# EAGLE design USB_Dongle_Parem (EAGLE 6.5.0)
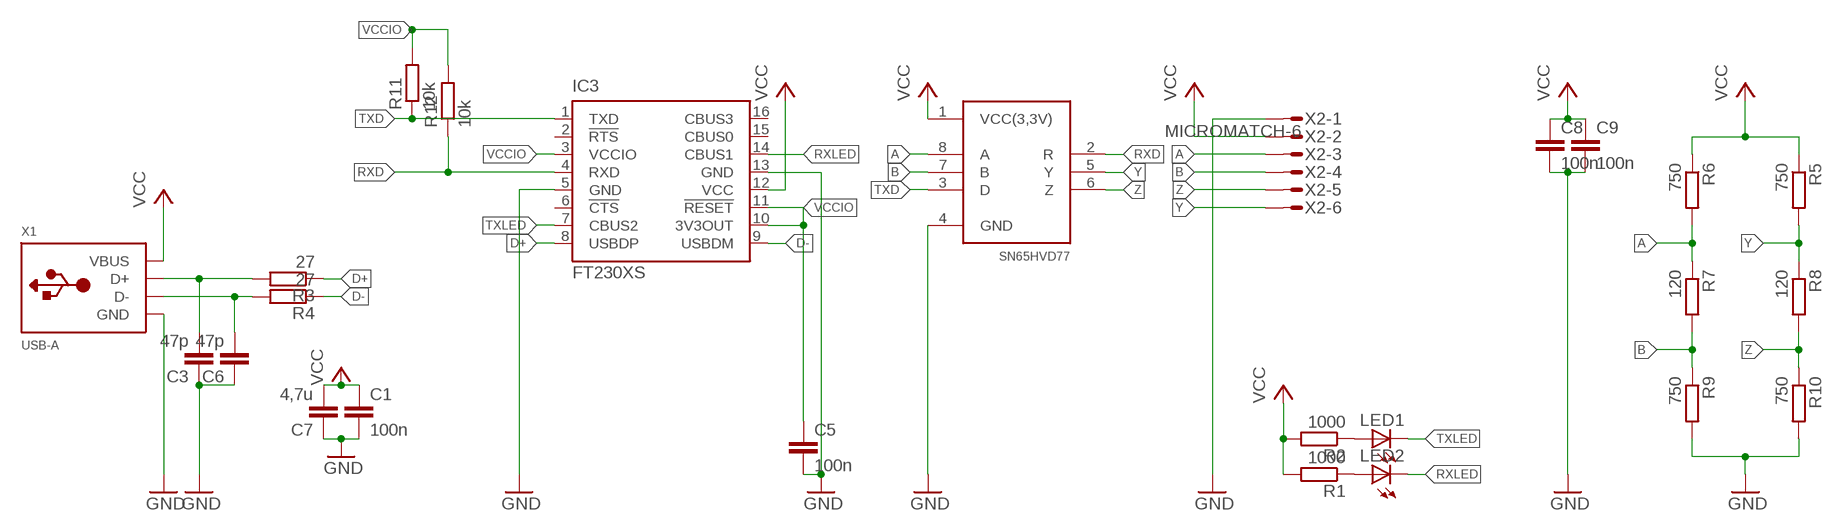
[diagram p0: schematic, sheet 1]

## Parts
C1  100n  CC0603  [C0603]
C3  47p  CC0603  [C0603]
C5  100n  CC0603  [C0603]
C6  47p  CC0603  [C0603]
C7  4,7u  CC1206  [C1206]
C8  100n  CC0603  [C0603]
C9  100n  CC0603  [C0603]
IC3  FT230XS  [SSOP16]
LED1  LED_ESML0603  [LED_SML0603]
LED2  LED_ESML0603  [LED_SML0603]
R1  1000  R-EU_R0603  [R0603]
R2  1000  R-EU_R0603  [R0603]
R3  27  R-EU_R0603  [R0603]
R4  27  R-EU_R0603  [R0603]
R5  750  R-EU_R0603  [R0603]
R6  750  R-EU_R0603  [R0603]
R7  120  R-EU_R0603  [R0603]
R8  120  R-EU_R0603  [R0603]
R9  750  R-EU_R0603  [R0603]
R10  750  R-EU_R0603  [R0603]
R11  10k  R-EU_R0603  [R0603]
R12  10k  R-EU_R0603  [R0603]
U$2  SN65HVD77D  [SOIC-8]
X1  USB-A  [MOLEX_480371000]
X2  MICROMATCH-6  [MICROMATCH-6]

## Nets
A: R6.2 R7.1 U$2.8(A) X2.3
B: R7.2 R9.1 U$2.7(B) X2.4
D+: IC3.8(USBDP) R3.1
D-: IC3.9(USBDM) R4.1
GND: C1.2 C3.1 C5.2 C6.1 C7.1 C8.2 C9.2 IC3.5(GND) IC3.13(GND) R9.2 R10.2 U$2.4(GND) X1.4(GND) X2.1
N$7: LED2.A R1.1
N$8: LED1.A R2.1
RXD: IC3.4(RXD) R12.1 U$2.2(R)
RXLED: IC3.14(CBUS1) LED2.C
SA: C3.2 R3.2 X1.3(D+)
SAD: C6.2 R4.2 X1.2(D-)
TXD: IC3.1(TXD) R11.1 U$2.3(D)
TXLED: IC3.7(CBUS2) LED1.C
VCC: C1.1 C7.2 C8.1 C9.1 IC3.12(VCC) R1.2 R2.2 R5.1 R6.1 U$2.1(VCC(3,3V)) X1.1(VBUS) X2.2
VCCIO: C5.1 IC3.3(VCCIO) IC3.10(3V3OUT) IC3.11(!RESET) R11.2 R12.2
Y: R5.2 R8.1 U$2.5(Y) X2.6
Z: R8.2 R10.1 U$2.6(Z) X2.5
Unconnected: IC3.2(!RTS) IC3.6(!CTS) IC3.15(CBUS0) IC3.16(CBUS3)

## Library data of the parts
C1 C3 C5-C9 = eagle-ltspice:C: CAPACITOR, European symbol; SPICEMODEL: NONE; SPICEPREFIX: C
IC3 = ftdichip:FT230X: USB to BASIC UART IC Auto generated by make-symbol-device-package-bsdl.ulp Rev. 43 Source: Data sheet <http://www.ftdichip.com/Support/Documents/DataSheets/ICs/DS_FT230X.pdf>
LED1 LED2 = eagle-ltspice:LED_E: LED Source: http://www.osram.convergy.de Source: www.luxeon.com Source: www.kingbright.com; SPICEMODEL: NONE; SPICEPREFIX: D; SPICETYPE: diode
R1-R12 = resistor:R-EU_: RESISTOR, European symbol
U$2 = Kommunikatsioon:SN65HVD77D
X1 = adafruit:USB-A: USB type A 'plug' Used for things that can directly connect to a USB port, say USB key
X2 = con-amp-micromatch:MICROMATCH-6: MicroMaTch 6 7-215464-6 / 0-215464-6 Drawing Number C-215464 DDEController.pdf; MPN: 7-215464-6; OC_FARNELL: 3784630; OC_NEWARK: 19R8125

## Board
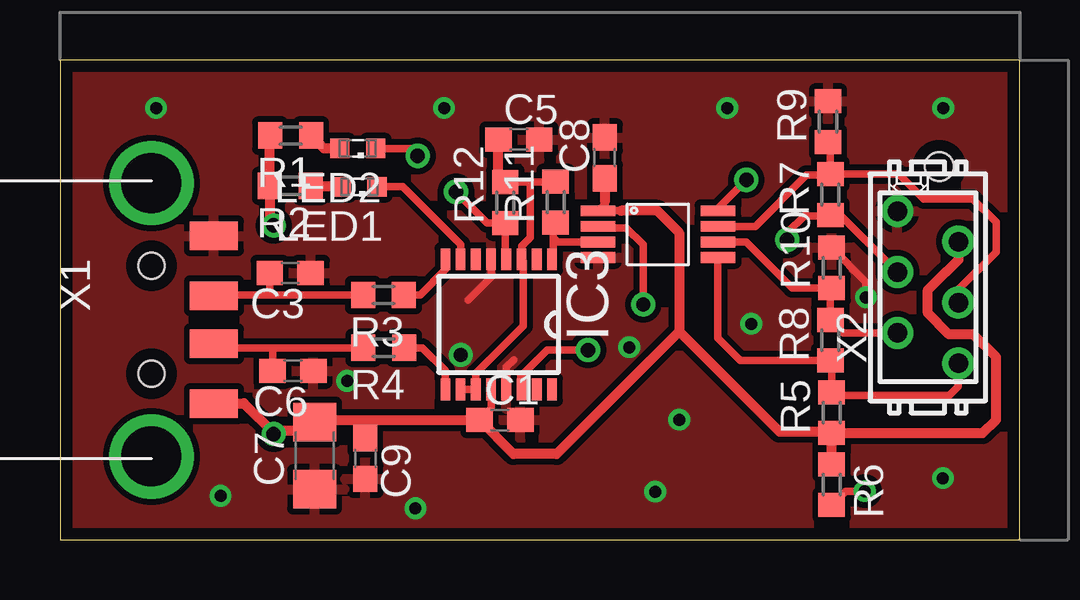
[diagram p1: board, top side]
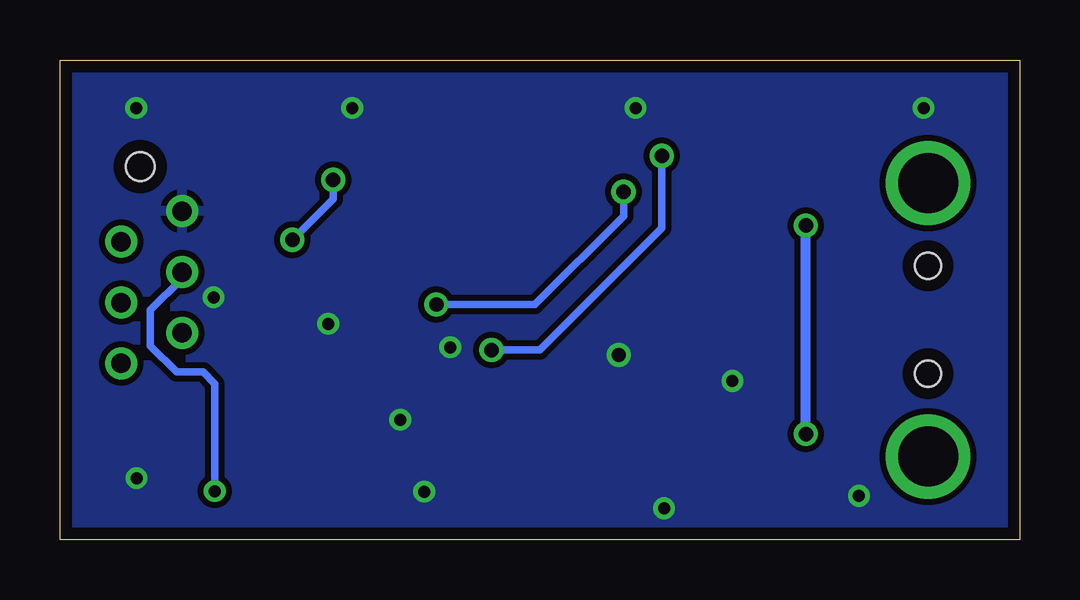
[diagram p2: board, bottom side, seen from below]

Size 39.98 x 20.01 mm. Coordinates in mm from the lower left corner, seen from the top.
Outline: 0,0.01 39.98,0 39.98,20 0,20.01 0,0.01
Copper layers (1*16): Top 0.035mm / dielectric 1.5mm / Bottom 0.035mm
Design rules "EDT_DRC": minimum track width 0.3mm, minimum drill 0.5mm, track to track 0.25mm, track to pad 0.25mm, pad to pad 0.25mm, via to via 0.25mm, smd to smd 0mil, copper to edge 0.5mm, drill to drill 8mil, minimum pad ring 10mil, minimum via ring 8mil, stop-mask expansion 4mil, vias tented up to drill 0mil, thermal gap 10mil
Holes 1.2 mm at 36.64,15.56

### Footprints (pad centres in the part's own frame; a part is rotated, then mirrored left to right if it is on the bottom)
C0603 = smd 1.1 x 1: 1 -0.85,0; 2 0.85,0
C1206 = smd 1.6 x 1.8: 1 -1.4,0; 2 1.4,0
SSOP16 = smd 0.914 x 0.406: 1 -2.718,2.223; 2 -2.718,1.587; 3 -2.718,0.953; 4 -2.718,0.318; 5 -2.718,-0.318; 6 -2.718,-0.953; 7 -2.718,-1.587; 8 -2.718,-2.223; 9 2.718,-2.223; 10 2.718,-1.587; 11 2.718,-0.953; 12 2.718,-0.318; 13 2.718,0.318; 14 2.718,0.953; 15 2.718,1.587; 16 2.718,2.223
LED_SML0603 = smd 0.8 x 0.8: A 0.75,0; C -0.75,0
R0603 = smd 1 x 1.1: 1 -0.85,0; 2 0.85,0
SOIC-8 = smd 0.45 x 1.45: 1 -0.99,-2.49; 2 -0.34,-2.49; 3 0.31,-2.49; 4 0.96,-2.49; 5 0.96,2.51; 6 0.31,2.51; 7 -0.34,2.51; 8 -0.99,2.51
MOLEX_480371000 = smd 1.2 x 2: 1 3.5,2.6; 2 1,2.6; 3 -1,2.6; 4 -3.5,2.6 | drill 2.5: M1 -5.7,0; M2 5.7,0 | hole 1.1: -2.25,0; 2.25,0
MICROMATCH-6 = drill 0.813: 1 3.175,1.27; 2 1.905,-1.27; 3 0.635,1.27; 4 -0.635,-1.27; 5 -1.905,1.27; 6 -3.175,-1.27

### Placement (x,y rotation side)
C1  18.33,4.99 0 top
C3  9.59,11.13 180 top
C5  19.12,16.69 0 top
C6  9.71,7.05 180 top
C7  10.61,3.51 90 top
C8  22.7,15.93 90 top
C9  12.72,3.39 270 top
IC3  18.28,8.98 270 top
LED1  12.46,14.72 180 top
LED2  12.41,16.32 180 top
R1  9.61,16.86 180 top
R2  9.59,14.76 180 top
R3  13.48,10.21 180 top
R4  13.49,8.01 180 top
R5  32.15,5.3 90 top
R6  32.15,2.3 270 top
R7  32.1,14.4 90 top
R8  32.1,8.32 90 top
R9  32,17.44 90 top
R10  32.15,11.34 90 top
R11  20.65,14.08 90 top
R12  18.55,14.06 90 top
U$2  24.91,12.73 270 top
X1  3.81,9.17 270 top
X2  36.16,10.53 90 top

### Tracks (layer width: path | path; a pad name or v marks a point on that pad's centre or on a via)
A  (via drill 0.5, 0.6)
  Top 0.305: U$2.8 27.42,13.83 v28.6,15.01 | v30.3,12.51 30.3,12.81 31,13.51 32.06,13.51 R7.1 32.26,13.71 32.34,13.71 X2.3 | v33.53,2.03 32.73,2.03 R6.2
  Bottom 0.305: v28.6,15.01 28.6,14.21 v30.3,12.51 | X2.3 34.89,10.9 36.21,9.58 36.21,8.08 35.12,6.99 34.02,6.99 33.53,6.5 v33.53,2.03
B
  Top 0.305: U$2.7 28.96,13.07 31.1,15.21 31.59,15.21 | 31.59,15.21 32.06,15.21 R7.2 | R7.2 32.1,16.49 R9.1 | 32.26,15.41 R7.2 | X2.4 37.43,10.43 39,12 39,13.24 38.03,14.21 35.99,14.21 34.95,15.25 R7.2 | 31.61,15.23 31.59,15.21 | 32.13,15.22 R7.2
D+
  Top 0.305: IC3.8 16.06,11.27 15,10.21 R3.1
D-
  Top 0.305: IC3.9 16.06,7.05 15.1,8.01 R4.1
GND  (via drill 0.5, 0.6)
  Top 0.305: IC3.5 17.96,11.05 18,11.01 17,10.01 | IC3.13 18.6,7.01 | 18.6,7.01 | 18.6,7.01 18.6,7.21 18.9,7.51 | v33.58,10.11 33.58,10.76 R10.2
  other vias: 16.7,7.71 11.96,6.62 23.72,8.03 14.81,1.31 16,18.01 4,18.01 24.8,2.01 27.8,18.01 28.8,9.01 36.79,2.57 6.69,1.83 25.8,5.01 36.8,18.01
  pour Top: 0,24.14 49.53,24.14 49.53,0.01 0,0.01
  pour Bottom: 0,24.14 49.53,24.14 49.53,0.01 0,0.01
N$7
  Top 0.406: LED2.A 11,16.32 R1.1
N$8
  Top 0.305: 10.48,14.72 R2.1
  Top 0.406: LED1.A 10.48,14.72
RXD  (via drill 0.6)
  Top 0.305: IC3.4 18.55,11.7 R12.1 17.8,13.21 v16.5,14.51 | v24.3,9.81 24.3,12.31 23.6,13.01 22.48,13.01 U$2.2
  Bottom 0.305: v16.5,14.51 16.5,13.51 20.2,9.81 v24.3,9.81
RXLED  (via drill 0.6)
  Top 0.305: LED2.C 14.59,16.32 v14.9,16.01 | v22,7.91 20.3,7.91 19.2,6.81 19.2,6.29 IC3.14
  Bottom 0.305: v14.9,16.01 14.9,13.01 20,7.91 v22,7.91
SA
  Top 0.305: R3.2 8.6,10.21 | 8.6,10.21 6.45,10.21 X1.3 | C3.2 8.74,10.35 8.6,10.21
SAD
  Top 0.305: R4.2 8.8,8.01 | 8.8,8.01 6.58,8.01 X1.2 | C6.2 8.86,7.95 8.8,8.01
TXD
  Top 0.305: IC3.1 20.55,11.7 20.55,12.61 | 20.55,12.61 20.55,13.13 R11.1 | U$2.3 20.74,12.42 20.55,12.61
TXLED
  Top 0.305: LED1.C 14.29,14.72 16.7,12.31 IC3.7
VCC  (via drill 0.6)
  Top 0.305: 32.09,4.51 R5.1 | 8.74,13.27 v8.9,13.11 | 8.74,16.84 R1.2 | 36.91,11.17 36.93,11.17 | X2.2 | IC3.12 17.96,5.47 C1.1 17.4,4.91 | 10.26,4.41 10.26,4.56 C7.2 | 23.38,13.72 U$2.1 22.71,14.01 22.71,14.14
  Top 0.406: R6.1 R5.1 38.44,4.45 39,5.01 39,7.62 38.05,8.57 37.04,8.57 36.16,9.45 36.16,10.42 36.91,11.17 | 25.8,8.69 25.8,12.81 24.89,13.72 23.38,13.72 | 8.74,13.27 R2.2 8.74,16.84 | 36.93,11.17 37.44,11.68 X2.2 | 25.8,8.69 20.69,3.58 18.89,3.58 C1.1 12.75,4.99 | X1.1 6.42,5.69 7.66,5.69 8.9,4.45 | 8.9,4.45 v8.9,4.41 | 8.9,4.45 9.01,4.56 10.26,4.56 | C7.2 10.69,4.99 12.75,4.99 | 12.75,4.99 12.72,4.96 C9.1 | 32.09,4.51 29.98,4.51 25.8,8.69 | C8.1 22.7,14.15 22.71,14.14
  Bottom 0.406: v8.9,4.41 v8.9,13.11
VCCIO
  Top 0.305: IC3.10 IC3.11 17.33,6.94 19.3,8.91 19.3,11.63 IC3.3 19.23,12.24 19.6,12.61 19.6,14.91 | 19.6,14.91 20.63,14.91 R11.2 | 19.6,14.91 R12.2
  Top 0.406: R12.2 18.27,14.91 C5.1
Y
  Top 0.305: U$2.5 27.4,11.75 27.4,8.41 28.34,7.47 R8.1 32.15,7.42 R5.2 32.28,6.02 37.05,6.02 37.43,6.4 X2.6
Z
  Top 0.305: U$2.6 28.6,12.41 30.52,10.49 R10.1 32.15,10.39 32.1,10.34 R8.2 32.65,8.62 X2.5